# EAGLE design stm32g071_pcb (EAGLE 9.6.2)
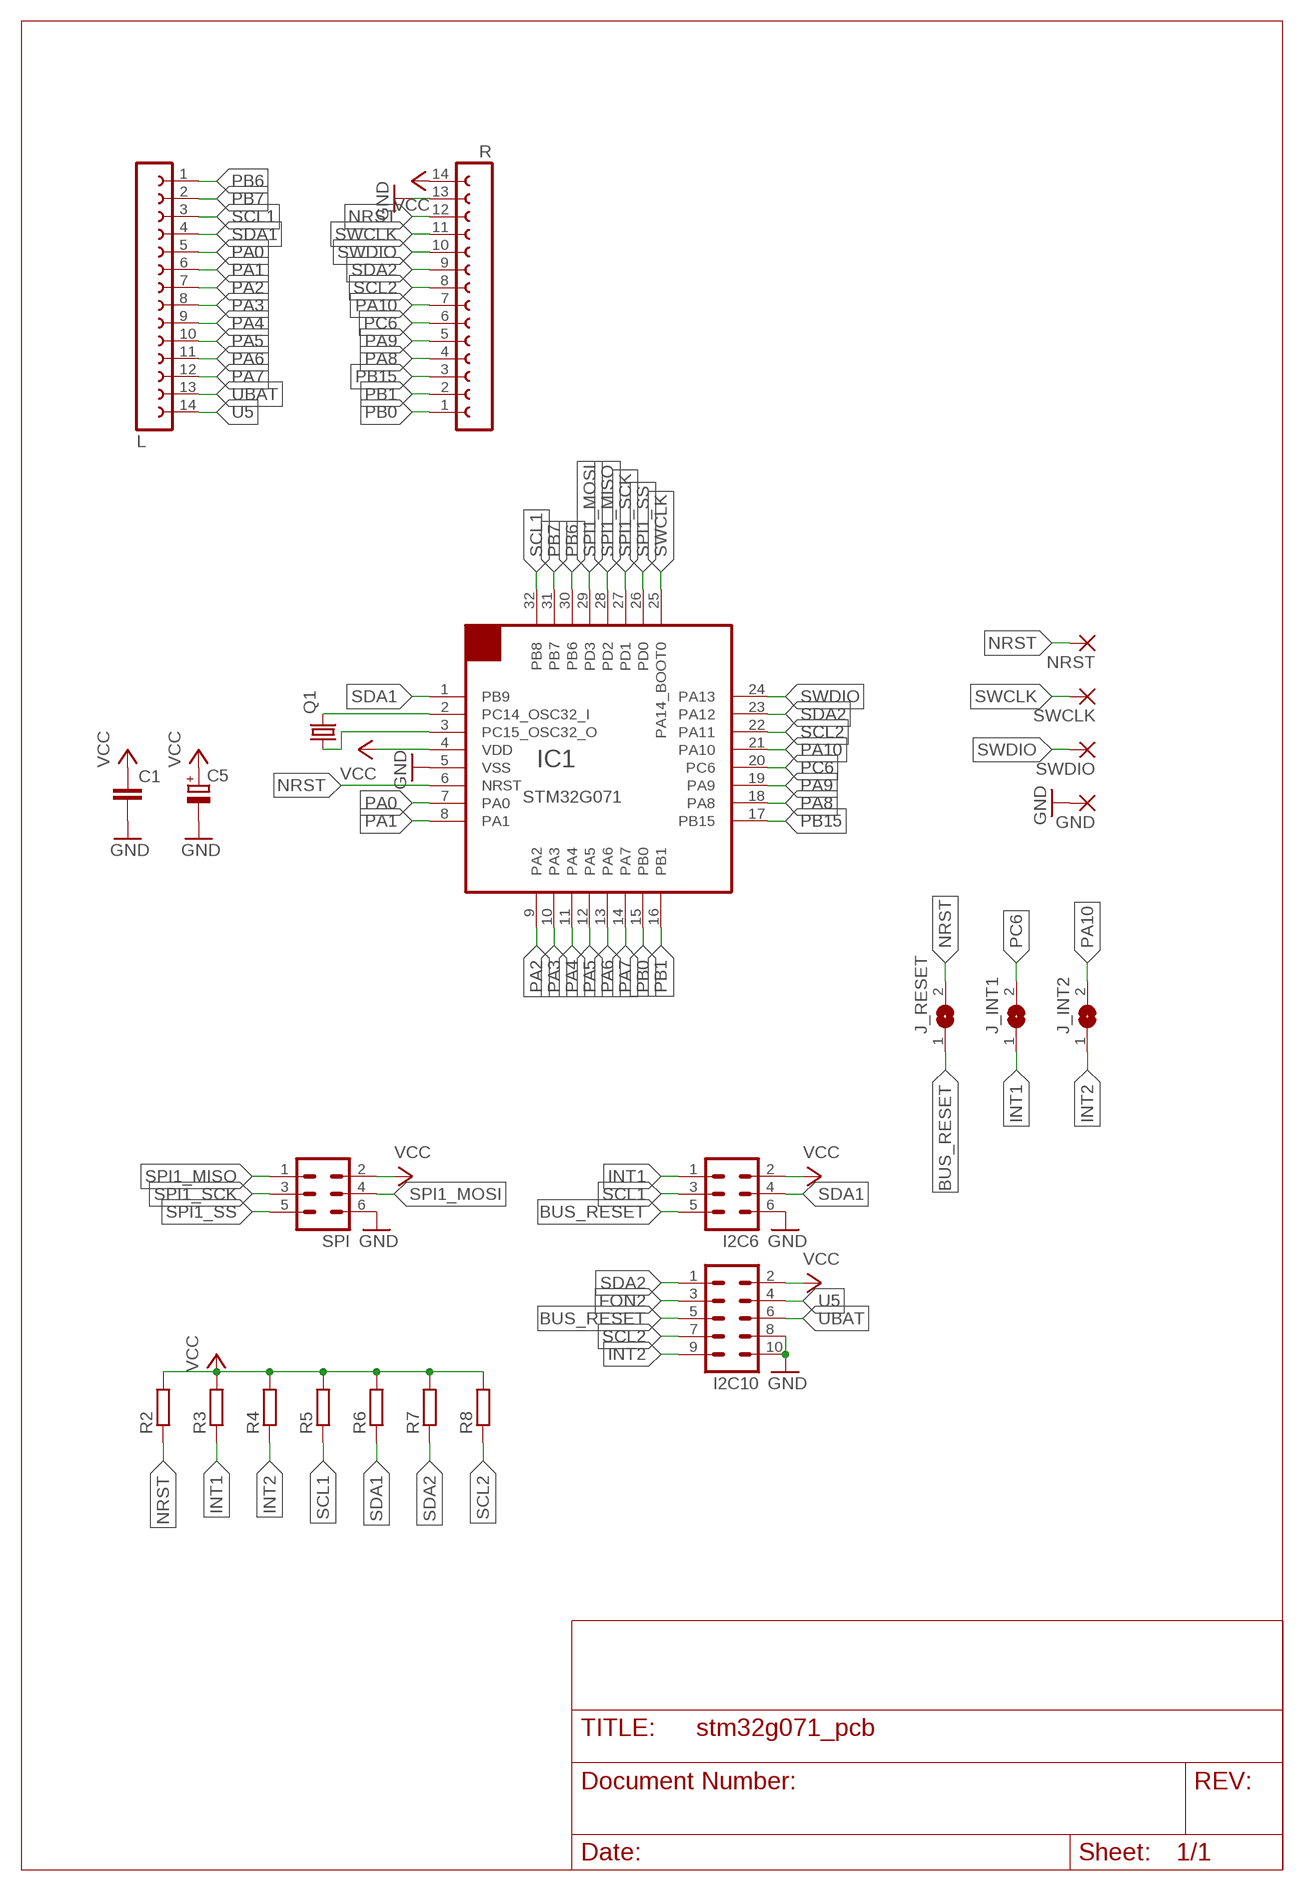
[diagram p0: schematic, sheet 1]

## Parts
C1  C-EUC0805  [C0805]
C5  CPOL-EUB/3528-21W  [B/3528-21W]
GND  1,6/0,8  [1,6/0,8]
I2C6  ML6  [ML6]
I2C10  ML10  [ML10]
IC1  STM32G071  STM32G071KBT6N  [LQFP-32]
J_INT1  SJ  [SJ]
J_INT2  SJ  [SJ]
J_RESET  SJ  [SJ]
L  FE14-1  [FE14]
NRST  1,6/0,8  [1,6/0,8]
Q1  CRYSTALTC26V  [TC26V]
R  FE14-1  [FE14]
R2  R-EU_R0805  [R0805]
R3  R-EU_R0805  [R0805]
R4  R-EU_R0805  [R0805]
R5  R-EU_R0805  [R0805]
R6  R-EU_R0805  [R0805]
R7  R-EU_R0805  [R0805]
R8  R-EU_R0805  [R0805]
SPI  ML6  [ML6]
SWCLK  1,6/0,8  [1,6/0,8]
SWDIO  1,6/0,8  [1,6/0,8]

## Nets
BUS_RESET: I2C6.5 I2C10.5 J_RESET.1
FON2: I2C10.3
GND [GND]: C1.2 C5.- GND.1(P) I2C6.6 I2C10.8 I2C10.10 IC1.5(VSS) R.13 SPI.6
INT1: I2C6.1 J_INT1.1 R3.1
INT2: I2C10.9 J_INT2.1 R4.1
N$30: IC1.2(PC14_OSC32_I) Q1.2
N$31: IC1.3(PC15_OSC32_O) Q1.1
NRST: IC1.6(NRST) J_RESET.2 NRST.1(P) R2.1 R.12
PA0: IC1.7(PA0) L.5
PA1: IC1.8(PA1) L.6
PA2: IC1.9(PA2) L.7
PA3: IC1.10(PA3) L.8
PA4: IC1.11(PA4) L.9
PA5: IC1.12(PA5) L.10
PA6: IC1.13(PA6) L.11
PA7: IC1.14(PA7) L.12
PA8: IC1.18(PA8) R.4
PA9: IC1.19(PA9) R.5
PA10: IC1.21(PA10) J_INT2.2 R.7
PB0: IC1.15(PB0) R.1
PB1: IC1.16(PB1) R.2
PB6: IC1.30(PB6) L.1
PB7: IC1.31(PB7) L.2
PB15: IC1.17(PB15) R.3
PC6: IC1.20(PC6) J_INT1.2 R.6
SCL1: I2C6.3 IC1.32(PB8) L.3 R5.1
SCL2: I2C10.7 IC1.22(PA11) R8.1 R.8
SDA1: I2C6.4 IC1.1(PB9) L.4 R6.1
SDA2: I2C10.1 IC1.23(PA12) R7.1 R.9
SPI1_MISO: IC1.28(PD2) SPI.1
SPI1_MOSI: IC1.29(PD3) SPI.4
SPI1_SCK: IC1.27(PD1) SPI.3
SPI1_SS: IC1.26(PD0) SPI.5
SWCLK: IC1.25(PA14_BOOT0) R.11 SWCLK.1(P)
SWDIO: IC1.24(PA13) R.10 SWDIO.1(P)
U5 [Power]: I2C10.4 L.14
UBAT [Power]: I2C10.6 L.13
VCC [Power]: C1.1 C5.+ I2C6.2 I2C10.2 IC1.4(VDD) R2.2 R3.2 R4.2 R5.2 R6.2 R7.2 R8.2 R.14 SPI.2

## Library data of the parts
C1 = rcl:C-EU: CAPACITOR, European symbol; SPICEPREFIX: C
C5 = rcl:CPOL-EU: POLARIZED CAPACITOR, European symbol; SPICEPREFIX: C
GND NRST SWCLK SWDIO = wirepad:1,6/0,8: THROUGH-HOLE PAD
I2C6 SPI = con-harting-ml:ML6: HARTING; OC_FARNELL: unknown; OC_NEWARK: unknown
I2C10 = con-harting-ml:ML10: HARTING; OC_FARNELL: unknown; OC_NEWARK: unknown
IC1 = STM32:STM32G071KBT6N
J_INT1 J_INT2 J_RESET = jumper:SJ: SMD solder JUMPER
L R = con-lsta-my:FE14-1: FEMALE HEADER
Q1 = crystal:CRYSTAL: CRYSTAL; OC_FARNELL: unknown; OC_NEWARK: unknown
R2-R8 = rcl:R-EU_: RESISTOR, European symbol; SPICEPREFIX: R

## Net classes
1 GND: width 0.635 mm
2 Power: width 0.635 mm

## Board
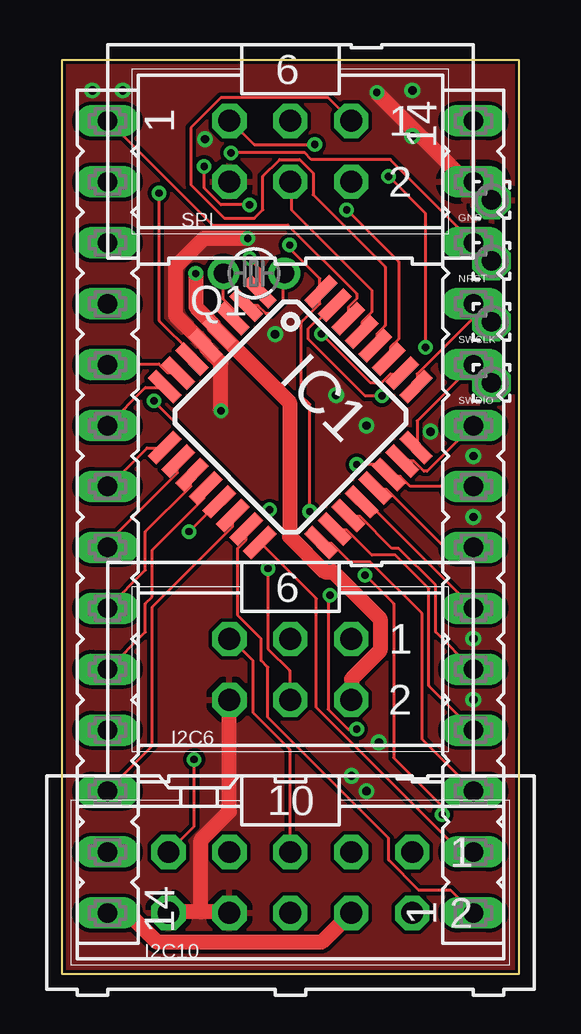
[diagram p1: board, top side]
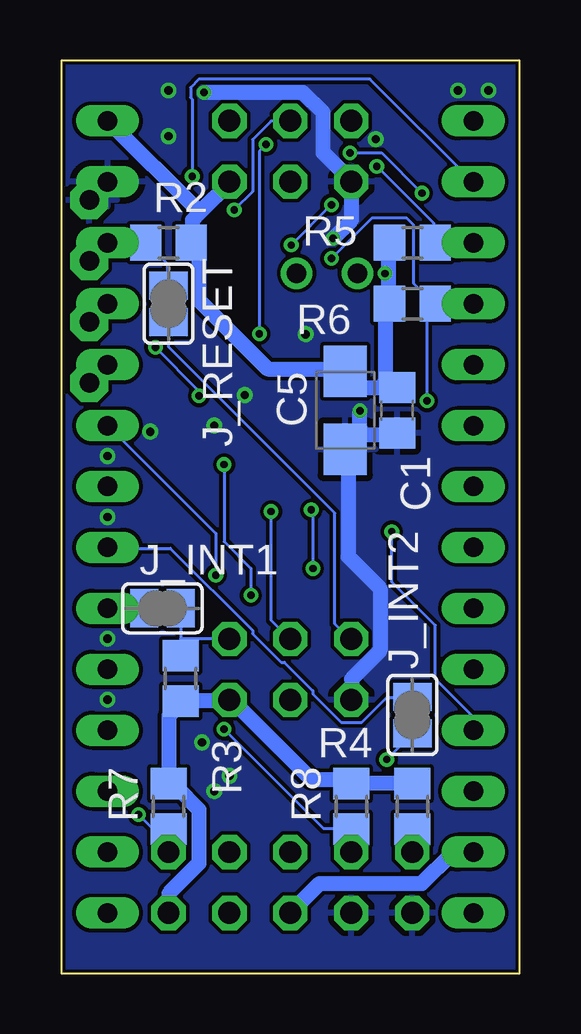
[diagram p2: board, bottom side, seen from below]

Size 19.05 x 38.1 mm. Coordinates in mm from the lower left corner, seen from the top.
Outline: 0,0 19.05,0 19.05,38.1 0,38.1 0,0
Copper layers (1*16): Top 0.035mm / dielectric 1.5mm / Bottom 0.035mm
Design rules "eagle *": minimum track width 5mil, minimum drill 12mil, track to track 6mil, track to pad 6mil, pad to pad 6mil, via to via 6mil, smd to smd 0mil, copper to edge 5mil, drill to drill 10mil, minimum pad ring 10mil, minimum via ring 6mil, stop-mask expansion 2mil, vias tented up to drill 25mil, thermal gap 10mil

### Footprints (pad centres in the part's own frame; a part is rotated, then mirrored left to right if it is on the bottom)
C0805 = smd 1.3 x 1.5: 1 -0.95,0; 2 0.95,0
B/3528-21W = smd 2.15 x 1.8: + 1.625,0; - -1.625,0
1,6/0,8 = drill 0.813 pad 1.6 octagon: 1 0,0
ML6 = drill 0.914 octagon: 1 -2.54,-1.27; 2 -2.54,1.27; 3 0,-1.27; 4 0,1.27; 5 2.54,-1.27; 6 2.54,1.27
ML10 = drill 0.914 octagon: 1 -5.08,-1.27; 2 -5.08,1.27; 3 -2.54,-1.27; 4 -2.54,1.27; 5 0,-1.27; 6 0,1.27; 7 2.54,-1.27; 8 2.54,1.27; 9 5.08,-1.27; 10 5.08,1.27
LQFP-32 = smd 1.5 x 0.5: 1 -1.8,0; 2 -1.8,-0.8; 3 -1.8,-1.6; 4 -1.8,-2.4; 5 -1.8,-3.2; 6 -1.8,-4; 7 -1.8,-4.8; 8 -1.8,-5.6; 17 7.4,-5.6; 18 7.4,-4.8; 19 7.4,-4; 20 7.4,-3.2; 21 7.4,-2.4; 22 7.4,-1.6; 23 7.4,-0.8; 24 7.4,0 | smd 0.5 x 1.5: 9 0,-7.4; 10 0.8,-7.4; 11 1.6,-7.4; 12 2.4,-7.4; 13 3.2,-7.4; 14 4,-7.4; 15 4.8,-7.4; 16 5.6,-7.4; 25 5.6,1.8; 26 4.8,1.8; 27 4,1.8; 28 3.2,1.8; 29 2.4,1.8; 30 1.6,1.8; 31 0.8,1.8; 32 0,1.8
SJ = smd 1.168 x 1.6: 1 -0.762,0; 2 0.762,0
FE14 = drill 0.813 long: 1 -15.24,0; 2 -12.7,0; 3 -10.16,0; 4 -7.62,0; 5 -5.08,0; 6 -2.54,0; 7 0,0; 8 2.54,0; 9 5.08,0; 10 7.62,0; 11 10.16,0; 12 12.7,0; 13 15.24,0; 14 17.78,0
TC26V = drill 0.813: 1 -1.27,0; 2 1.27,0
R0805 = smd 1.3 x 1.5: 1 -0.95,0; 2 0.95,0

### Placement (x,y rotation side)
C1  5.08,23.5 270 bottom
C5  7.24,23.5 90 bottom
GND  17.91,32.26 0 top
I2C6  9.53,12.7 180 top
I2C10  9.53,3.81 180 top
IC1  9.53,27.18 315 top
J_INT1  14.86,15.24 180 bottom
J_INT2  4.45,10.79 90 bottom
J_RESET  14.61,27.94 90 bottom
L  1.91,20.32 270 top
NRST  17.91,29.72 0 top
Q1  8,29.21 0 top
R  17.14,17.78 90 top
R2  14.61,30.48 0 bottom
R3  14.1,12.32 270 bottom
R4  4.45,6.99 90 bottom
R5  4.45,30.48 180 bottom
R6  4.45,27.94 180 bottom
R7  14.61,6.99 90 bottom
R8  6.99,6.99 90 bottom
SPI  9.53,34.29 180 top
SWCLK  17.91,27.18 0 top
SWDIO  17.91,24.64 0 top

### Tracks (layer width: path | path; a pad name or v marks a point on that pad's centre or on a via)
BUS_RESET
  Top 0.127: I2C10.5 9.49,5.1 9.49,9.36 7.96,10.9 7.96,13.06 7.05,13.97 I2C6.5
  Bottom 0.127: J_RESET.1 14.59,27.17 14.59,26.12 7.68,19.21 7.68,14.6 7.05,13.97 I2C6.5
GND  (via drill 0.3, 0.35)
  Top 0.635: 5.79,2.58 6.98,2.58 I2C10.8 | 5.79,2.58 4.46,2.58 I2C10.10 | 5.79,2.58 5.79,5.59 6.98,6.78 6.98,11.39 I2C6.6 | GND.1 17.88,32.27 17.18,32.97 R.13 16.83,33.04 v13.12,36.74 | v6.63,23.47 6.63,25.5 6,26.12 IC1.5 5.79,26.4 4.74,27.45 4.74,29.48 5.93,30.66 v7.75,30.66
  Bottom 0.635: C1.2 5.09,22.49 6.63,22.49 7.19,21.93 C5.- | v6.63,23.47 6.63,22.77 C5.- | v7.75,30.66 6.98,31.43 6.98,32.97 SPI.6 7.19,33.25 8.17,34.23 8.17,35.9 9,36.74 v13.12,36.74 | I2C6.6 6.98,11.46 6.98,12.29 5.79,13.48 5.79,16.07 7.12,17.39 7.12,21.58 C5.-
  other vias: 11.43,24.13 12.7,22.86 15.37,22.61 14.61,34.92 14.61,36.83 1.27,36.83 2.54,36.83 13.21,9.65 12.06,8.26 12.7,7.62 17.14,19.05 17.14,21.59 17.14,13.97 17.14,11.43 8.89,26.67 5.97,34.8
  pour Top: 0,0 19.05,0 19.05,38.1 0,38.1
  pour Bottom: 0,0 19.05,0 19.05,38.1 0,38.1
INT1
  Bottom 0.127: 14.1,13.97 14.1,15.23 J_INT1.1 | 14.1,13.97 R3.1 | I2C6.1 14.1,13.97
INT2  (via drill 0.3)
  Top 0.127: v5.51,8.94 5.51,6.15 I2C10.9
  Bottom 0.127: R4.1 4.46,6.01 4.46,5.1 I2C10.9 | v5.51,8.94 4.46,9.99 J_INT2.1
N$30
  Top 0.127: IC1.2 7.75,27.87 8.17,27.87 8.52,27.52 8.72,27.52 9.21,28.01 9.21,29.2 Q1.2
N$31
  Top 0.127: IC1.3 7.12,27.38 7.12,27.73 6.7,28.15 6.7,29.2 Q1.1
NRST  (via drill 0.3)
  Top 0.127: v4.04,32.55 4.04,27.24 5.37,25.91 5.37,25.64 IC1.6 | v7.05,34.23 10.12,34.23 10.4,33.95 13.68,33.95 17.11,30.52 R.12 17.18,30.45 17.88,29.76 NRST.1
  Bottom 0.127: v4.04,32.55 5.72,34.23 v7.05,34.23 | R.12 17.11,30.52 15.57,30.52 R2.1 15.5,30.45 14.66,29.62 14.66,28.71 J_RESET.2
PA0
  Top 0.127: IC1.7 4.81,25.08 4.39,25.08 4.04,25.43 1.95,25.43 L.5
PA1
  Top 0.127: IC1.8 4.25,24.45 3.49,24.45 1.95,22.91 L.6
PA2
  Top 0.127: IC1.9 4.25,21.93 3.56,21.93 1.95,20.33 L.7
PA3
  Top 0.127: IC1.10 4.81,21.37 4.81,20.89 1.95,18.02 1.95,17.81 L.8
PA4
  Top 0.127: IC1.11 5.37,20.75 5.37,20.33 3.49,18.44 3.49,16.83 1.95,15.3 L.9
PA5
  Top 0.127: IC1.12 5.93,20.19 5.93,19.84 3.77,17.67 3.77,15.72 3.49,15.44 3.49,14.25 1.95,12.71 L.10
PA6  (via drill 0.3)
  Top 0.127: v5.3,18.44 6.49,19.63 IC1.13
  Bottom 0.127: v5.3,18.44 5.3,16.34 3.49,14.53 3.49,12.29 1.95,10.76 1.95,10.2 L.11
PA7
  Top 0.127: IC1.14 7.12,19.07 7.12,18.65 3.77,15.3 3.77,9.5 1.95,7.68 L.12
PA8
  Top 0.127: R.4 15.29,12.01 15.29,16.07 13.89,17.46 12.92,17.46 11.87,18.51 11.38,18.51 IC1.18
PA9
  Top 0.127: IC1.19 11.94,19.07 12.43,19.07 13.75,17.74 14.03,17.74 15.57,16.2 15.57,14.25 17.11,12.71 R.5
PA10
  Top 0.127: IC1.21 13.12,20.19 13.54,20.19 15.92,17.81 17.11,17.81 R.7
  Bottom 0.127: J_INT2.2 4.46,11.53 5.51,11.53 6.56,10.48 7.4,10.48 8.59,11.66 8.59,11.8 9.77,12.99 9.91,12.99 11.1,14.18 11.1,14.32 14.52,17.74 17.11,17.74 R.7
PB0
  Top 0.127: IC1.15 7.68,18.51 7.68,18.09 7.33,17.74 7.33,14.95 8.31,13.97 8.31,13.06 8.59,12.78 8.59,10.69 13.61,5.66 13.61,4.75 14.87,3.49 16.2,3.49 17.11,2.58 R.1
PB1
  Top 0.127: IC1.16 8.31,17.95 10.61,15.65 10.61,11.11 16.62,5.1 17.11,5.1 R.2
PB6
  Top 0.127: IC1.30 11.94,27.38 11.94,27.8 12.29,28.15 12.29,28.36 9.42,31.22 6.28,31.22 1.95,35.55 L.1
PB7  (via drill 0.3)
  Top 0.127: v13.34,24.1 12.64,24.1 10.26,26.47 10.26,26.89 10.61,27.24 10.68,27.24 11.31,27.87 IC1.31 | v15.15,26.12 15.15,31.71 v13.61,33.25
  Bottom 0.127: v13.34,24.1 13.34,24.31 v15.15,26.12 | v13.61,33.25 13.61,36.46 13.68,36.53 13.68,36.95 13.34,37.3 6.21,37.3 1.95,33.04 L.2
PB15
  Top 0.127: IC1.17 10.82,17.95 11.24,17.95 12.01,17.18 12.85,17.18 15.01,15.02 15.01,9.78 17.11,7.68 R.3
PC6
  Top 0.127: IC1.20 12.5,19.63 12.78,19.63 17.11,15.3 R.6
  Bottom 0.127: J_INT1.2 15.64,15.3 17.11,15.3 R.6
SCL1  (via drill 0.3)
  Top 0.127: v10.33,19.28 10.33,23.75 9.98,24.1 9.98,27.17 10.75,27.94 10.75,28.43 IC1.32 10.75,28.5 10.75,28.99 9.49,30.25 v9.49,30.39 | v5.93,33.67 5.93,32.76 6.63,32.06 v7.82,32.06
  Bottom 0.127: L.3 1.95,30.52 3.49,30.52 R5.1 3.56,30.52 3.56,31.29 v5.93,33.67 | v10.33,19.28 10.33,14.74 9.56,13.97 I2C6.3 | v9.49,30.39 v7.82,32.06
SCL2  (via drill 0.3)
  Top 0.127: R.8 17.11,20.33 14.52,20.33 14.1,20.75 13.68,20.75 IC1.22 13.61,20.82 13.2,21.23 v12.29,21.23 | v12.29,10.2 11.94,10.2 11.1,11.04 11.1,15.72 v11.17,15.79
  Bottom 0.127: I2C10.7 6.98,5.1 6.98,6.01 R8.1 7.05,6.08 8.17,6.08 v12.29,10.2 | v11.17,15.79 11.17,16.9 12.29,18.02 v12.29,21.23
SDA1  (via drill 0.3)
  Top 0.127: v7.82,29.83 8.24,29.41 8.24,28.5 IC1.1 | v8.59,16.9 8.59,13.55 9.49,12.64 9.49,11.46 I2C6.4 | v8.65,19.35 8.38,19.35 v3.83,23.89
  Bottom 0.127: L.4 R6.1 | v7.82,29.83 6.14,31.5 4.67,31.5 4.39,31.22 4.39,28.78 3.56,27.94 R6.1 | v8.59,16.9 8.59,19.28 v8.65,19.35 | v3.83,23.89 3.83,27.73 3.63,27.94 R6.1
SDA2  (via drill 0.3)
  Top 0.127: IC1.23 14.24,21.37 14.66,21.37 15.08,20.95 15.22,20.95 17.11,22.84 R.9 | v15.85,6.64 15.85,6.99 13.82,9.01 13.82,15.44 v12.64,16.62
  Bottom 0.127: I2C10.1 14.59,5.1 14.59,6.01 R7.1 14.66,6.08 15.29,6.08 v15.85,6.64 | v12.64,16.62 12.64,18.37 17.11,22.84 R.9
SPI1_MISO
  Top 0.127: IC1.28 13.12,26.19 13.12,26.68 13.47,27.03 13.47,29.48 10.47,32.48 10.47,33.39 9.91,33.95 9.07,33.95 8.38,33.25 8.38,31.85 8.03,31.5 6.77,31.5 5.37,32.9 5.37,35.27 6.63,36.53 11.1,36.53 12.01,35.62 SPI.1
SPI1_MOSI
  Top 0.127: IC1.29 12.5,26.82 12.5,27.17 12.92,27.59 12.92,28.5 9.56,31.85 9.56,32.97 SPI.4
SPI1_SCK  (via drill 0.3)
  Top 0.127: v11.87,31.85 14.03,29.69 14.03,26.47 13.68,26.12 13.68,25.64 IC1.27
  Bottom 0.127: v11.87,31.85 11.1,32.62 11.1,34.78 10.33,35.55 9.56,35.55 SPI.3
SPI1_SS  (via drill 0.3)
  Top 0.127: v10.82,26.68 12.85,24.66 13.34,24.66 13.68,25.01 14.17,25.01 IC1.26 | v10.54,34.58 8.03,34.58 7.05,35.55 SPI.5
  Bottom 0.127: v10.82,26.68 10.82,34.3 v10.54,34.58
SWCLK
  Top 0.127: 17.07,27.28 17.11,27.31 17.11,27.94 R.11 | 17.07,27.28 14.8,25.01 14.8,24.52 IC1.25 | SWCLK.1 17.88,27.24 17.11,27.24 17.07,27.28
SWDIO
  Top 0.127: IC1.24 14.8,22 14.8,23.05 17.11,25.36 R.10 17.18,25.36 17.88,24.66 SWDIO.1
U5
  Top 0.635: L.14 1.95,2.52 2.79,2.52 3.98,1.33 10.82,1.33 12.01,2.52 I2C10.4
UBAT
  Bottom 0.635: L.13 1.95,5.03 2.79,5.03 4.04,3.77 8.31,3.77 9.49,2.58 I2C10.6
VCC  (via drill 0.3)
  Top 0.635: v5.58,29.2 5.58,27.8 6.35,27.03 6.35,26.96 6.49,26.82 IC1.4 6.77,26.54 9.49,23.82 9.49,18.23 10.96,16.76 11.31,16.76 13.27,14.81 13.27,13.48 12.08,12.29 12.08,11.46 I2C6.2
  Bottom 0.635: R4.2 4.46,7.96 6.98,7.96 R8.2 7.26,8.1 8.65,8.1 11.8,11.25 I2C6.2 12.08,11.39 14.03,11.39 R3.2 14.24,11.11 14.59,10.76 14.59,7.96 R7.2 14.31,7.82 13.34,6.84 13.34,4.61 14.59,3.35 14.59,2.58 I2C10.2 | 5.44,29.2 5.44,30.45 R5.2 | 5.44,29.2 5.44,27.94 R6.2 5.58,27.66 5.58,24.73 C1.1 5.09,24.45 6.56,24.45 7.19,25.08 C5.+ 7.54,25.22 10.47,25.22 13.34,28.08 13.34,29.97 13.54,30.18 R2.2 13.61,30.52 13.61,31.43 13.3,31.75 | v5.58,29.2 5.44,29.2 | 13.3,31.75 12.08,32.97 SPI.2 | 13.3,31.75 17.11,35.55 R.14

### Text on the board
_tNames: L | L | SPI | SPI | GND | GND | NRST | NRST | Q1 | Q1 | SWCLK | SWCLK | IC1 | IC1 | SWDIO | SWDIO | I2C6 | I2C6 | I2C10 | I2C10
_bNames: R5 | R5 | R2 | R2 | R6 | R6 | C5 | C5 | C1 | C1 | J_RESET | J_RESET | J_INT1 | J_INT1 | J_INT2 | J_INT2 | R4 | R4 | R3 | R3 | R8 | R8 | R7 | R7